# Altium schematic sheet Din24x.SchDoc
size A3
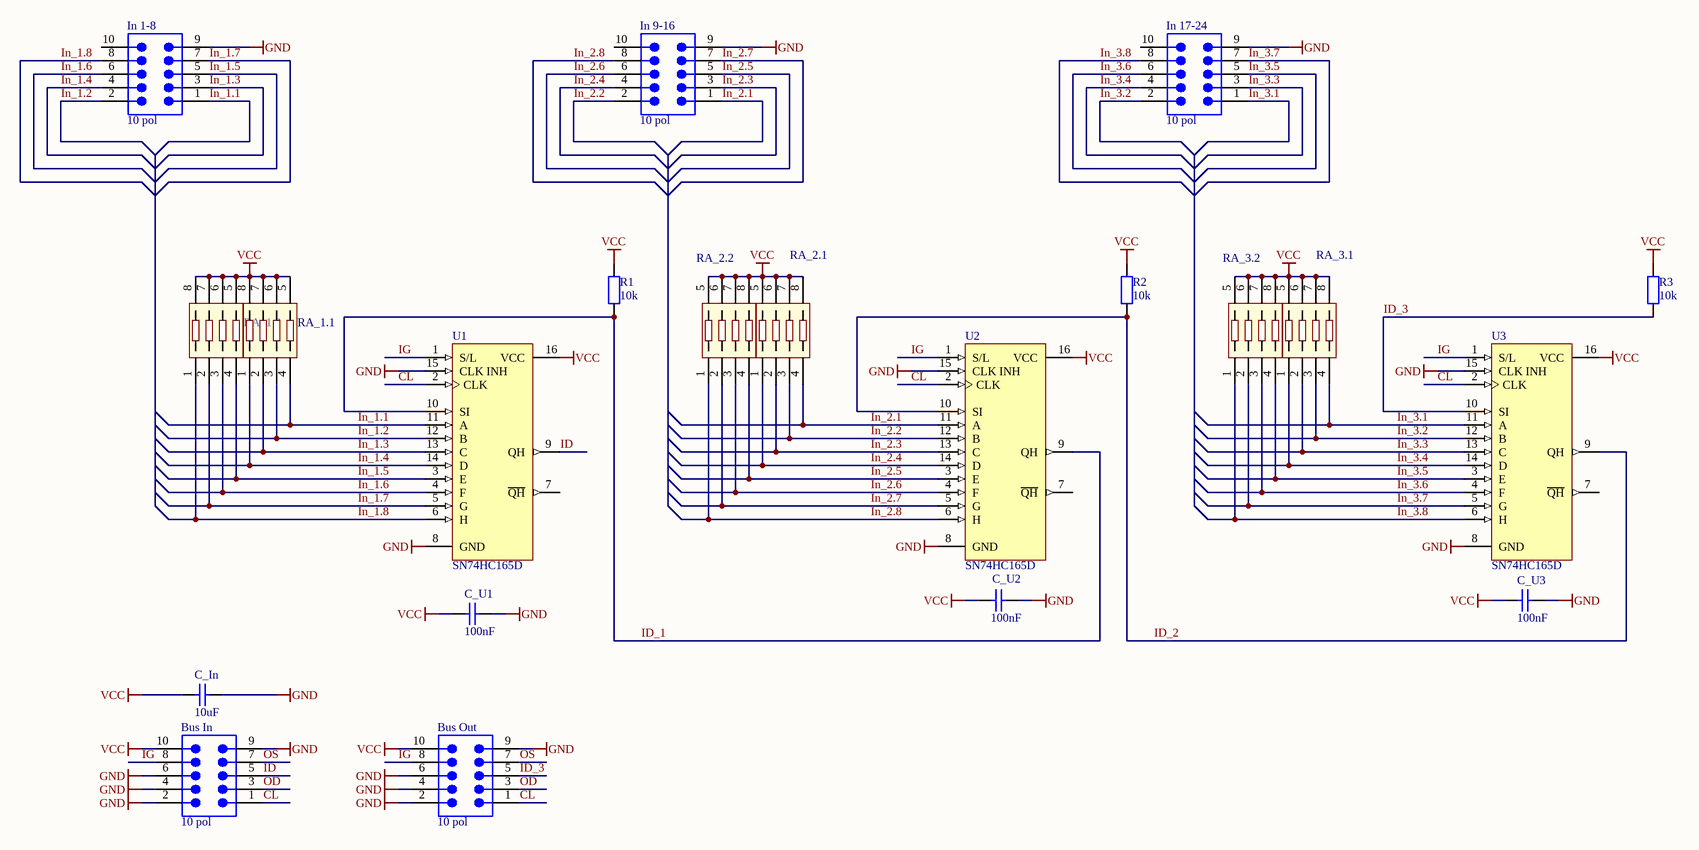
[diagram p0: Din24x.SchDoc]

## Parts
Bus_In  10 pol  [918510x324]
Bus_Out  10 pol  [918510x324]
C_In  value 10uF  [1608[0603]]  (hidden comment: Cap Semi)
C_U1  value 100nF  [6-0805_M]  (hidden comment: Cap Semi)
C_U2  value 100nF  [6-0805_M]  (hidden comment: Cap Semi)
C_U3  value 100nF  [6-0805_M]  (hidden comment: Cap Semi)
In_1-8  10 pol  [918510x324]
In_9-16  10 pol  [918510x324]
In_17-24  10 pol  [918510x324]
R1  value 10k  [6-0805_M]  (hidden comment: Res2)
R2  value 10k  [6-0805_M]  (hidden comment: Res2)
R3  value 10k  [6-0805_M]  (hidden comment: Res2)
RA_1.1  EXB38  [EXB38]  (value not drawn)
RA_1.2  EXB38  [EXB38]  (value not drawn)
RA_2.1  EXB38  [EXB38]  (value not drawn)
RA_2.2  EXB38  [EXB38]  (value not drawn)
RA_3.1  EXB38  [EXB38]  (value not drawn)
RA_3.2  EXB38  [EXB38]  (value not drawn)
U1  SN74HC165D  [D016_L]
U2  SN74HC165D  [D016_L]
U3  SN74HC165D  [D016_L]

## Nets
GND: Bus_In.2 Bus_In.4 Bus_In.6 Bus_In.9 Bus_Out.2 Bus_Out.4 Bus_Out.6 Bus_Out.9 C_In.1 C_U1.1 C_U2.1 C_U3.1 In_1-8.9 In_9-16.9 In_17-24.9 U1.8(GND) U1.15(CLK_INH) U2.8(GND) U2.15(CLK_INH) U3.8(GND) U3.15(CLK_INH)
VCC: Bus_In.10 Bus_Out.10 C_In.2 C_U1.2 C_U2.2 C_U3.2 R1.2 R2.2 R3.2 RA_1.1.5 RA_1.1.6 RA_1.1.7 RA_1.1.8 RA_1.2.5 RA_1.2.6 RA_1.2.7 RA_1.2.8 RA_2.1.5 RA_2.1.6 RA_2.1.7 RA_2.1.8 RA_2.2.5 RA_2.2.6 RA_2.2.7 RA_2.2.8 RA_3.1.5 RA_3.1.6 RA_3.1.7 RA_3.1.8 RA_3.2.5 RA_3.2.6 RA_3.2.7 RA_3.2.8 U1.16(VCC) U2.16(VCC) U3.16(VCC)
CL: Bus_In.1 Bus_Out.1 U1.2(CLK) U2.2(CLK) U3.2(CLK)
ID: Bus_In.5 U1.9(QH)
ID_1: R1.1 U1.10(SI) U2.9(QH)
ID_2: R2.1 U2.10(SI) U3.9(QH)
ID_3: Bus_Out.5 R3.1 U3.10(SI)
IG: Bus_In.8 Bus_Out.8 U1.1(S/L) U2.1(S/L) U3.1(S/L)
In_1.1: In_1-8.1 RA_1.1.4 U1.11(A)
In_1.2: In_1-8.2 RA_1.1.3 U1.12(B)
In_1.3: In_1-8.3 RA_1.1.2 U1.13(C)
In_1.4: In_1-8.4 RA_1.1.1 U1.14(D)
In_1.5: In_1-8.5 RA_1.2.4 U1.3(E)
In_1.6: In_1-8.6 RA_1.2.3 U1.4(F)
In_1.7: In_1-8.7 RA_1.2.2 U1.5(G)
In_1.8: In_1-8.8 RA_1.2.1 U1.6(H)
In_2.1: In_9-16.1 RA_2.1.4 U2.11(A)
In_2.2: In_9-16.2 RA_2.1.3 U2.12(B)
In_2.3: In_9-16.3 RA_2.1.2 U2.13(C)
In_2.4: In_9-16.4 RA_2.1.1 U2.14(D)
In_2.5: In_9-16.5 RA_2.2.4 U2.3(E)
In_2.6: In_9-16.6 RA_2.2.3 U2.4(F)
In_2.7: In_9-16.7 RA_2.2.2 U2.5(G)
In_2.8: In_9-16.8 RA_2.2.1 U2.6(H)
In_3.1: In_17-24.1 RA_3.1.4 U3.11(A)
In_3.2: In_17-24.2 RA_3.1.3 U3.12(B)
In_3.3: In_17-24.3 RA_3.1.2 U3.13(C)
In_3.4: In_17-24.4 RA_3.1.1 U3.14(D)
In_3.5: In_17-24.5 RA_3.2.4 U3.3(E)
In_3.6: In_17-24.6 RA_3.2.3 U3.4(F)
In_3.7: In_17-24.7 RA_3.2.2 U3.5(G)
In_3.8: In_17-24.8 RA_3.2.1 U3.6(H)
OD: Bus_In.3 Bus_Out.3
OS: Bus_In.7 Bus_Out.7

Not connected (* = marked no-connect by the designer): In_1-8 10; In_9-16 10; In_17-24 10; U1 7(~{QH}); U2 7(~{QH}); U3 7(~{QH})

## Library data of the parts
Bus_In Bus_Out In_1-8 In_9-16 In_17-24 = 09 18 510 6324: Flat Cable Connector (IDC), Low-Profile Male Header, Straight Solder Pin, 10 Contacts, Performance Level 2; PCB_Layout: Complies with manufacturer's recommendation.; DrillSize: Corresponds to nominal value.; Published: 15-Nov-2004; DatasheetDocument: Sep-2003; PackageDocument: 03-Jun-2003; PackageReference: 918510x324; Publisher: Altium Limited; ComponentLink1Description: Manufacturer Link; ComponentLink1URL: http://www.harting.com/; ComponentLink2Description: Selection Guide; ComponentLink2URL: http://www.harting.com/imperia/md/content/steckverbinderundsystemkomponenten/folder/interface_engl_chapter_09.pdf
C_In C_U1-C_U3 = Cap Semi: Capacitor (Semiconductor SIM Model); Published: 8-Jun-2000; LatestRevisionDate: 29-May-2009; LatestRevisionNote: IPC-7351 Footprint Added.; PackageReference: C1206; Publisher: Altium Limited; PackageDescription: Chip Capacitor
R1-R3 = Res2: Resistor; Published: 8-Jun-2000; LatestRevisionDate: 17-Jul-2002; LatestRevisionNote: Re-released for DXP Platform.; PackageReference: AXIAL-0.4; Publisher: Altium Limited; PackageDescription: Axial Device, Thru-Hole; 2 Leads; 0.4 in Pin Spacing
RA_1.1 RA_1.2 RA_2.1 RA_2.2 RA_3.1 RA_3.2 = 4 Resistors Parallel: Published: 8-Jun-2000; LatestRevisionDate: 29-May-2009; LatestRevisionNote: IPC-7351 Footprint Added.; PackageReference: C1206; Publisher: Altium Limited; PackageDescription: Chip Capacitor
U1-U3 = SN74HC165D: 8-Bit Parallel-Load Shift Register; Published: 8-Jun-2000; LatestRevisionDate: 13-Apr-2006; LatestRevisionNote: IPC-7351 Footprint Added.; DatasheetVersion: May-1997; PackageVersion: Jan-1998; PackageReference: D016; Publisher: Altium Limited; PackageDescription: 16-Pin Small Outline Integrated Circuit 1.27 mm Pitch; Code_IPC: SOIC127P600-16; ComponentLink1Description: Manufacturer Link; ComponentLink1URL: http://www.ti.com/; ComponentLink2Description: Datasheet; ComponentLink2URL: http://www-s.ti.com/sc/ds/sn74hc165.pdf